# EAGLE design Half_Inch_VCO_ Eval (EAGLE 7.2.0)
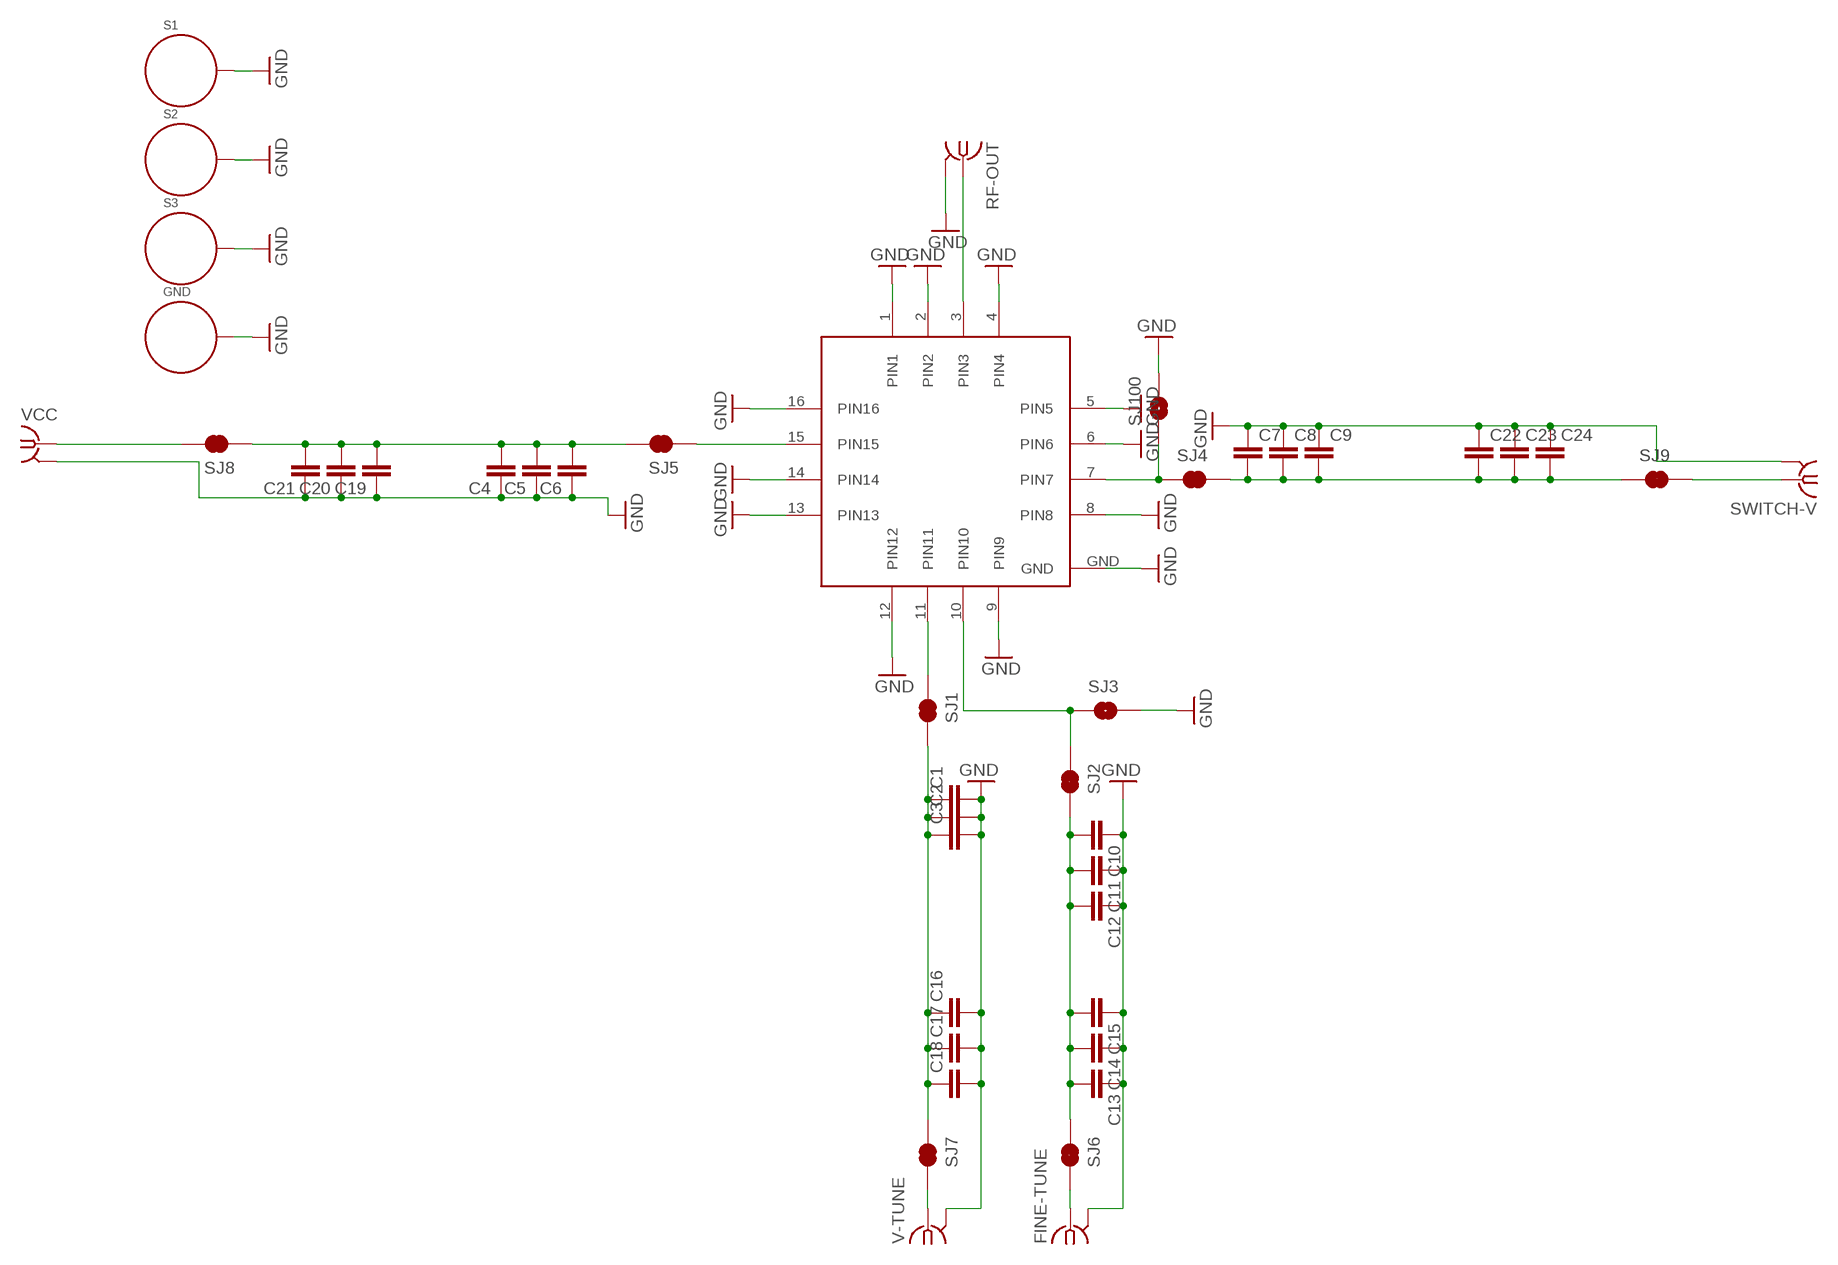
[diagram p0: schematic, sheet 1]

## Parts
C1  CAP0402-CAP  [0402-CAP]
C2  CAP0402-CAP  [0402-CAP]
C3  CAP0402-CAP  [0402-CAP]
C4  CAP0402-CAP  [0402-CAP]
C5  CAP0402-CAP  [0402-CAP]
C6  CAP0402-CAP  [0402-CAP]
C7  CAP0402-CAP  [0402-CAP]
C8  CAP0402-CAP  [0402-CAP]
C9  CAP0402-CAP  [0402-CAP]
C10  CAP0402-CAP  [0402-CAP]
C11  CAP0402-CAP  [0402-CAP]
C12  CAP0402-CAP  [0402-CAP]
C13  CAP0402-CAP  [0402-CAP]
C14  CAP0402-CAP  [0402-CAP]
C15  CAP0402-CAP  [0402-CAP]
C16  CAP0402-CAP  [0402-CAP]
C17  CAP0402-CAP  [0402-CAP]
C18  CAP0402-CAP  [0402-CAP]
C19  CAP0402-CAP  [0402-CAP]
C20  CAP0402-CAP  [0402-CAP]
C21  CAP0402-CAP  [0402-CAP]
C22  CAP0402-CAP  [0402-CAP]
C23  CAP0402-CAP  [0402-CAP]
C24  CAP0402-CAP  [0402-CAP]
FINE-TUNE  SMA-142-0701-801/806  [J502-ND-142-0701-801/806]
GND  STANDOFF_ELECTRICAL  [STANDOFF-ELECTRICAL]
RF-OUT  SMA-142-0701-871/876  [J502-ND-142-0701-871/876]
S1  STANDOFF_ELECTRICAL  [STANDOFF-ELECTRICAL]
S2  STANDOFF_ELECTRICAL  [STANDOFF-ELECTRICAL]
S3  STANDOFF_ELECTRICAL  [STANDOFF-ELECTRICAL]
SJ1  JUMPER-PAD-2-NC_BY_TRACE  [PAD-JUMPER-2-NC_BY_TRACE_YES_SILK]
SJ2  JUMPER-PAD-2-NC_BY_TRACE  [PAD-JUMPER-2-NC_BY_TRACE_YES_SILK]
SJ3  SOLDERJUMPER-OLDNC2  [SJ_2S-NOTRACE]
SJ4  JUMPER-PAD-2-NC_BY_TRACE  [PAD-JUMPER-2-NC_BY_TRACE_YES_SILK]
SJ5  JUMPER-PAD-2-NC_BY_TRACE  [PAD-JUMPER-2-NC_BY_TRACE_YES_SILK]
SJ6  JUMPER-PAD-2-NC_BY_TRACE  [PAD-JUMPER-2-NC_BY_TRACE_YES_SILK]
SJ7  JUMPER-PAD-2-NC_BY_TRACE  [PAD-JUMPER-2-NC_BY_TRACE_YES_SILK]
SJ8  JUMPER-PAD-2-NC_BY_TRACE  [PAD-JUMPER-2-NC_BY_TRACE_YES_SILK]
SJ9  JUMPER-PAD-2-NC_BY_TRACE  [PAD-JUMPER-2-NC_BY_TRACE_YES_SILK]
SJ100  SOLDERJUMPER-OLDNC2  [SJ_2S-NOTRACE]
SWITCH-V  SMA-142-0701-801/806  [J502-ND-142-0701-801/806]
U$1  RFVC6406  [RFVC6406]
V-TUNE  SMA-142-0701-801/806  [J502-ND-142-0701-801/806]
VCC  SMA-142-0701-801/806  [J502-ND-142-0701-801/806]

## Nets
GND: C1.2 C2.2 C3.2 C4.1 C5.1 C6.1 C7.1 C8.1 C9.1 C10.1 C11.1 C12.1 C13.1 C14.1 C15.1 C16.2 C17.2 C18.2 C19.1 C20.1 C21.1 C22.1 C23.1 C24.1 FINE-TUNE.G@1 FINE-TUNE.G@2 FINE-TUNE.G@3 FINE-TUNE.G@4 GND.P1 RF-OUT.G@1 RF-OUT.G@2 RF-OUT.G@3 RF-OUT.G@4 S1.P1 S2.P1 S3.P1 SJ3.2 SJ100.2 SWITCH-V.G@1 SWITCH-V.G@2 SWITCH-V.G@3 SWITCH-V.G@4 U$1.1(PIN1) U$1.2(PIN2) U$1.4(PIN4) U$1.5(PIN5) U$1.6(PIN6) U$1.8(PIN8) U$1.9(PIN9) U$1.12(PIN12) U$1.13(PIN13) U$1.14(PIN14) U$1.16(PIN16) U$1.GND V-TUNE.G@1 V-TUNE.G@2 V-TUNE.G@3 V-TUNE.G@4 VCC.G@1 VCC.G@2 VCC.G@3 VCC.G@4
N$1: SJ8.2 VCC.1
N$2: RF-OUT.1 U$1.3(PIN3)
N$3: C4.2 C5.2 C6.2 C19.2 C20.2 C21.2 SJ5.2 SJ8.1
N$4: SJ5.1 U$1.15(PIN15)
N$5: FINE-TUNE.1 SJ6.2
N$6: SJ4.1 SJ100.1 U$1.7(PIN7)
N$7: C7.2 C8.2 C9.2 C22.2 C23.2 C24.2 SJ4.2 SJ9.1
N$8: SJ9.2 SWITCH-V.1
N$26: SJ1.1 U$1.11(PIN11)
N$28: C1.1 C2.1 C3.1 C16.1 C17.1 C18.1 SJ1.2 SJ7.1
N$30: SJ7.2 V-TUNE.1
N$34: C10.2 C11.2 C12.2 C13.2 C14.2 C15.2 SJ2.2 SJ6.1
N$36: SJ2.1 SJ3.1 U$1.10(PIN10)

## Library data of the parts
C1-C24 = SparkFun-Capacitors:CAP: Capacitor Standard 0603 ceramic capacitor, and 0.1" leaded capacitor.
FINE-TUNE SWITCH-V V-TUNE VCC = con-coax:SMA-: SMA 50 Ohm End Launch Jack Receptacle - Round Contact Johnson Components Source: www.johnsoncomponents.com .. J502-ND.pdf; MF: JOHNSON COMPONENTS; MPN: 142-0701-801; OC_FARNELL: 1608592; OC_NEWARK: 90F2624
GND S1-S3 = SparkFun-Electromechanical:STANDOFF_ELECTRICAL: A standoff intended to be an electrically connected point. Pad size and stop size allow for a #4 Phillips pan screw head to make a solid connection to the board.
RF-OUT = SMA-coplanar:SMA-: SMA 50 Ohm End Launch Jack Receptacle - Round Contact Johnson Components Source: www.johnsoncomponents.com .. J502-ND.pdf; MF: JOHNSON COMPONENTS; MPN: 142-0701-871; OC_FARNELL: 1339835; OC_NEWARK: 91B6105
SJ1 SJ2 SJ4-SJ9 = SparkFun-Passives:JUMPER-PAD-2-NC_BY_TRACE
SJ3 SJ100 = SparkFun-Retired:SOLDERJUMPER-OLD: Solder Jumper Standard SMD solder jumper. Used to automate production. Two varients : Normally Open and Normally Closed are the same, but have different paste layers. NC will have a large amount of paste and should jumper during reflow.
U$1 = APA Parts:RFVC6406: Features ■ Octave Bandwidth 2000MHz to 4000MHz ■ -112dBc/Hz Typical at 100kHz Offset ■ POUT 11dBm Typical ■ 5V Supply ■ 45mA Current Consumption Applications ■ Test and Measurement Instrumentation ■ Wideband Radios for Military and Commercial Applications

## Board
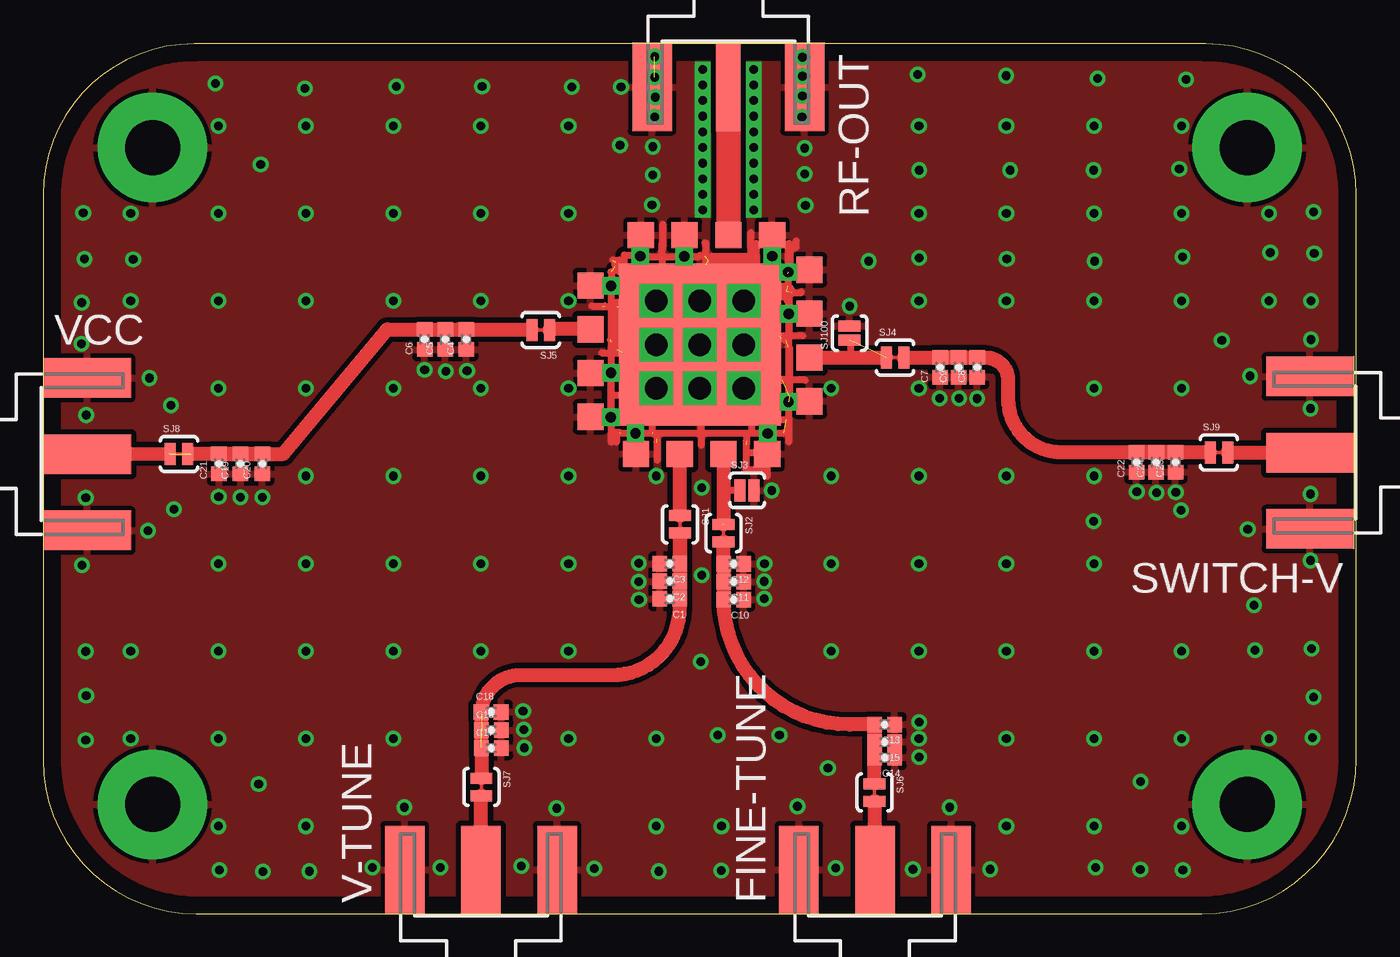
[diagram p1: board, top side]
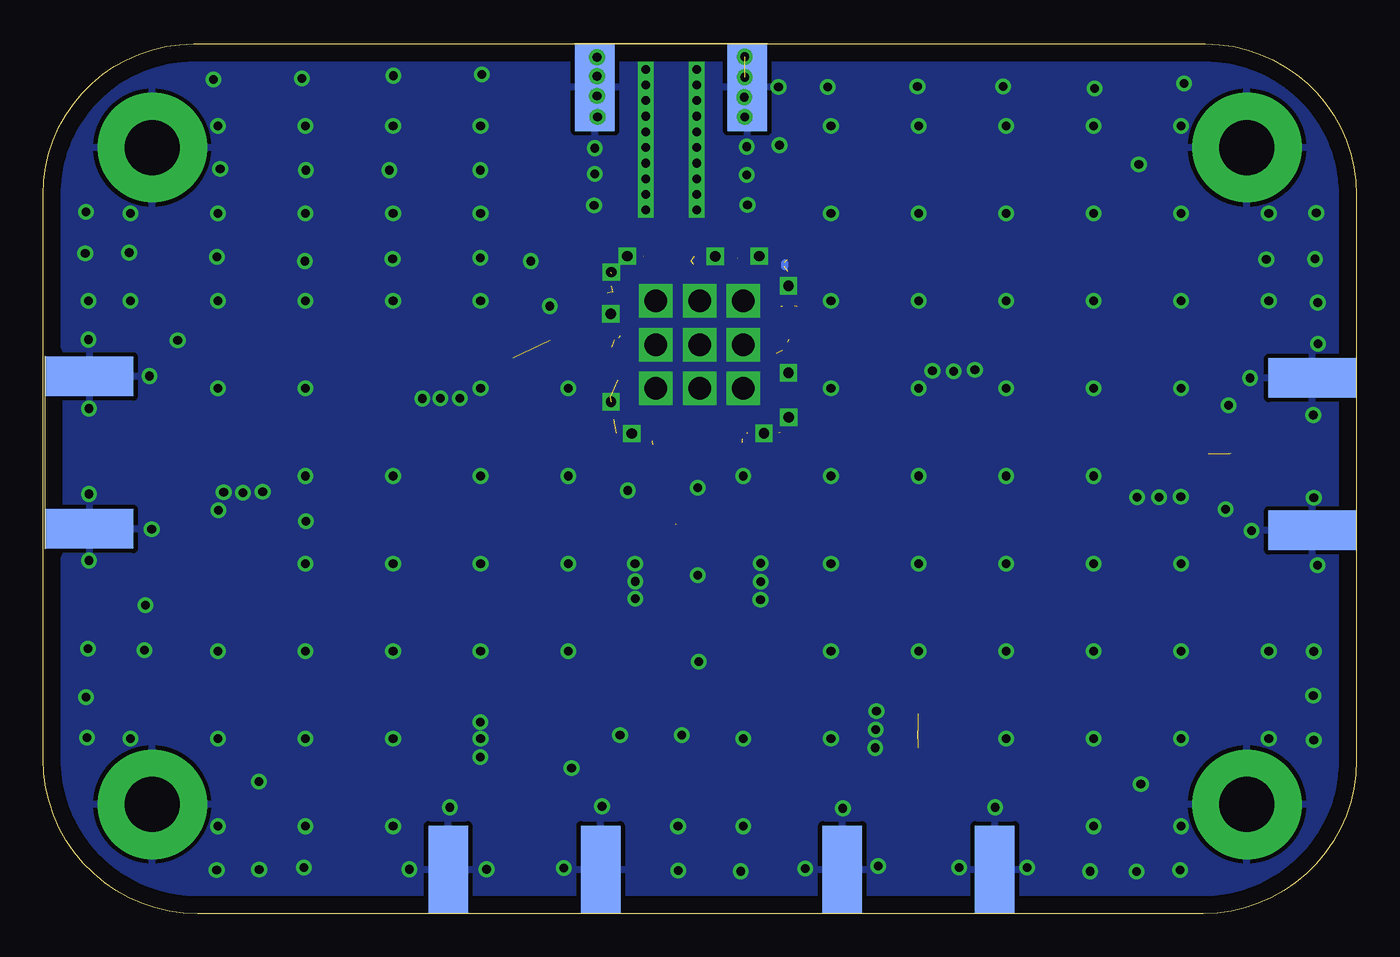
[diagram p2: board, bottom side, seen from below]

Size 76.18 x 50.52 mm. Coordinates in mm from the lower left corner, seen from the top.
Outline: 76.18,8.97 76.18,41.73 arc90 67.44,50.47 8.75,50.47 arc90 0,41.72 0,8.89 arc90 8.89,0 67.21,0 arc90 76.18,8.97
Copper layers (1*16): Top 0.035mm / dielectric 1.5mm / Bottom 0.035mm
Design rules "default *": minimum track width 10mil, minimum drill 24mil, track to track 8mil, track to pad 8mil, pad to pad 8mil, via to via 8mil, smd to smd 8mil, copper to edge 40mil, drill to drill 8mil, minimum pad ring 10mil, minimum via ring 8mil, stop-mask expansion 4mil, vias tented up to drill 0.02mm, thermal gap 10mil

### Footprints (pad centres in the part's own frame; a part is rotated, then mirrored left to right if it is on the bottom)
0402-CAP = smd 0.85 x 0.9: 1 -0.58,0; 2 0.58,0
J502-ND-142-0701-801/806 = smd 5.08 x 2.286: 1 2.565,0; G@1 2.565,4.42; G@2 2.565,-4.42 | smd 5.08 x 2.286 bottom: G@3 2.565,4.42; G@4 2.565,-4.42
STANDOFF-ELECTRICAL = drill 3.2 pad 6.35: P1 0,0
J502-ND-142-0701-871/876 = smd 5.08 x 1.422: 1 2.565,0 | smd 5.08 x 2.286: G@1 2.565,4.42; G@2 2.565,-4.42 | smd 5.08 x 2.286 bottom: G@3 2.565,4.42; G@4 2.565,-4.42
PAD-JUMPER-2-NC_BY_TRACE_YES_SILK = smd 0.635 x 1.27: 1 -0.508,0; 2 0.508,0
SJ_2S-NOTRACE = smd 0.635 x 1.27: 1 -0.401,0; 2 0.413,0
RFVC6406 = smd 1.52 x 1.52: 1 2.92,12.7; 2 5.46,12.7; 3 8,12.7; 4 10.54,12.7; 5 12.7,10.69; 6 12.7,8.15; 7 12.7,5.61; 8 12.7,3.07; 9 10.26,0; 10 7.72,0; 11 5.18,0; 12 2.64,0; 13 0,2.16; 14 0,4.7; 15 0,7.24; 16 0,9.78 | smd 9.4 x 9.4: GND 6.35,6.35

### Placement (x,y rotation side)
C1  36.36,18.27 180 top
C2  36.36,19.29 180 top
C3  36.36,20.31 180 top
C4  24.54,33.33 90 top
C5  23.32,33.33 90 top
C6  22.13,33.33 90 top
C7  52.03,31.71 90 top
C8  54.18,31.71 90 top
C9  53.11,31.7 90 top
C10  40.05,18.24 180 top
C11  40.05,19.27 180 top
C12  40.05,20.3 180 top
C13  48.81,10.99 180 top
C14  48.82,9.06 180 top
C15  48.82,9.97 180 top
C16  26,10.66 0 top
C17  26,9.62 0 top
C18  25.99,11.72 0 top
C19  11.45,26.1 90 top
C20  12.72,26.1 90 top
C21  10.2,26.1 90 top
C22  63.42,26.2 90 top
C23  65.68,26.21 90 top
C24  64.55,26.2 90 top
FINE-TUNE  48.26,0 90 top
GND  69.85,6.35 0 top
RF-OUT  39.75,50.52 270 top
S1  69.85,44.45 0 top
S2  6.35,44.45 0 top
S3  6.35,6.35 0 top
SJ1  36.95,22.59 270 top
SJ2  39.47,22.08 270 top
SJ3  40.83,24.57 0 top
SJ4  49.42,32.27 0 top
SJ5  28.87,33.88 180 top
SJ6  48.23,7.04 270 top
SJ7  25.42,7.36 270 top
SJ8  7.88,26.68 0 top
SJ9  68.2,26.77 0 top
SJ100  46.78,33.69 90 top
SWITCH-V  76.05,26.76 180 top
U$1  31.75,26.67 0 top
V-TUNE  25.4,0 90 top
VCC  0,26.67 0 top

### Tracks (layer width: path | path; a pad name or v marks a point on that pad's centre or on a via)
GND  (via drill 0.5, 0.6, 1.3)  (24 unrouted)
  Top 0.406: 33.14,37.83 33.17,37.83 33.17,37.64 | 33.04,37.93 33.43,37.93 33.43,37.25 | 32.94,37.25 32.96,37.25 32.96,36.84 | 31.84,35.27 32.59,35.27 32.59,35.23 | 32.46,35.23 33.39,35.23 33.39,35.38 | 32.96,33.17 32.96,36.19 | 33.3,35.23 33.3,32.7 | 32.4,32.54 33.64,32.54 | 34.59,38.12 38.04,38.12 38.04,38.13 | 35.91,38.05 35.91,37.33 | 35.95,38.57 35.95,39.98 | 35.62,27.54 35.62,26.33 | 35.34,27.86 35.6,27.86 35.6,27.35 | 33.51,27.88 42.95,27.88 42.95,27.9 | 35.34,27.93 35.34,28.59 | 32.91,33.31 32.96,33.31 32.96,27.37 | 33.43,27.93 33.26,27.93 33.26,27.37 | 41.16,27.88 40.79,27.88 40.79,27.24 | 40.82,27.43 40.78,27.43 40.78,25.79 41.99,25.79 41.99,25.4 | 43.17,35.55 43.24,35.55 43.24,27.39 | 38.18,27.18 38.18,28.5 | 42.77,28.68 43.08,28.68 | 44.2,30.96 42.85,30.96 | 43.21,32.89 43.29,32.89 43.29,29.98 | 44.06,33.52 42.7,33.52 42.7,33.56 | 43.43,36.05 43.98,36.05 43.98,36.09 | 42.64,36.1 42.71,36.03 | 43.21,37.15 43.21,36.43 | 43.36,38.4 43.32,38.4 43.32,37.41 43.24,37.41 43.24,38.91 | 41.08,39.52 41.03,39.52 41.03,38.4 | 38.38,38.92 38.43,38.92 38.43,37.68 | 35.91,38.05 35.89,38.05 35.89,38.84 | 38.75,38.15 41.35,38.15 41.35,37.88 38.59,37.88 38.59,37.85 | 41.35,38.16 41.37,38.16 41.37,38.9 | 43.34,38.66 43.68,38.66 43.68,39.05 | 38.09,38.19 38.38,38.19 38.38,38.15 | 42.8,33.4 43.05,33.4 43.05,33.27
  Top 1.016: 43.12,36.1 42.64,36.1
  Bottom 0.406: 33.17,37.78 33.17,37.54
  other vias: 42.04,27.87 34.36,27.87 32.92,28.81 32.94,31.39 32.94,36.43 34.65,38.16 37.19,38.13 42.3,38.16 43.22,37.23 43.25,34.81 43.23,29.7 46.78,35.25 38.1,33.02 35.56,35.56 35.56,33.02 35.56,30.48 38.1,30.48 40.64,30.48 40.64,33.02 40.64,35.56 38.1,35.56 10.16,45.72 15.24,45.72 20.32,45.72 25.4,45.72 30.48,45.72 35.36,42.86 44.19,44.42 50.8,45.72 55.88,45.72 60.96,45.72 66.04,45.72 66.04,40.64 71.12,40.64 71.12,35.56 70.01,31.2 70.25,17.9 70.3,15.29 71.12,10.16 66.04,5.08 66.04,10.16 66.04,15.24 60.96,5.08 55.88,5.08 52.59,6.18 43.76,6.24 39.35,5.08 35.56,5.08 29.79,6.12 20.96,6.18 15.24,5.08 10.16,5.08 10.16,10.16 10.16,15.24 10.16,20.32 5.08,15.24 5.08,10.16 6.08,22.22 6.18,31.08 5.08,35.56 5.08,40.64 10.16,40.64 15.24,40.64 20.32,40.64 25.4,40.64 30.48,40.64 10.16,35.56 15.24,35.56 20.32,35.56 25.4,35.56 30.48,35.56 10.16,30.48 15.24,25.4 15.24,30.48 15.24,20.32 15.24,15.24 15.24,10.16 20.32,10.16 20.32,15.24 20.32,20.32 20.32,25.4 20.32,30.48 25.4,30.48 25.4,25.4 25.4,20.32 25.4,15.24 30.48,15.24 30.48,20.32 30.48,25.4 30.48,30.48 35.56,25.4 35.56,10.16 30.48,10.16 39.14,10.38 50.8,10.16 55.88,10.16 60.96,10.16 60.96,15.24 55.88,15.24 50.8,15.24 45.72,15.24 45.72,20.32 45.72,25.4 45.72,30.48 50.8,30.48 50.8,25.4 50.8,20.32 55.88,20.32 60.96,20.32 60.94,22.79 60.96,25.4 55.88,25.4 55.88,25.4 60.96,30.48 66.04,30.48 66.04,35.56 60.96,35.56 55.88,35.56 50.8,35.56 60.96,40.64 55.88,40.64 50.8,40.64 44.22,41.09 35.32,41.12 38.27,44.46 38.27,43.55 38.27,42.64 38.27,41.74 38.27,40.83 41.23,44.46 41.23,43.55 41.23,42.64 41.23,41.74 41.23,40.83 38.27,49 38.27,48.09 38.27,47.18 38.27,46.27 38.27,45.37 41.23,49 41.23,48.09 41.23,47.18 41.23,46.27 41.23,45.37 38.15,14.62 38.21,19.65 38.21,24.71 44.17,42.92 33.46,44.59 66.01,23.42 69.88,22.31 45.53,8.46 39.34,2.52 7.58,23.47 7.41,29.51 10.18,24.19 11.44,24.18 12.72,24.18 22.13,31.55 23.35,31.48 24.6,31.51 27.92,9.63 27.88,10.68 27.84,11.75 50.82,9.09 50.82,11.11 41.84,20.32 41.82,19.28 41.82,18.28 34.55,20.34 34.55,19.26 34.57,18.22 42.28,24.56 52.01,29.92 53.14,29.91 54.19,29.9 63.44,24.48 64.6,24.43 65.71,24.45 73.52,20.5 73.56,33.32 54.93,2.58 50.46,2.58 45.98,2.66 42.71,10.37 35.71,2.47 31.98,2.62 27.74,2.77 23.04,2.69 19.09,2.69 15.44,2.47 10.22,2.54 12.75,2.45 2.25,20.22 2.47,15.22 2.47,10.08 12.5,7.53 2.5,12.66 61.05,2.69 66.11,2.54 63.64,2.57 73.57,15.37 73.64,10.23 73.69,12.57 63.65,7.68 73.51,24.36 73.53,29.31 35.37,44.51 33.53,47.97 50.73,48.7 55.87,48.62 61.16,48.47 66.31,48.4 73.74,38.31 73.54,35.57 73.69,40.72 68.37,33.28 2.47,24.14 2.5,28.93 2.23,33.06 2.24,35.46 2.33,40.67 5.23,37.96 30.67,47.97 25.46,48 20.49,48 15.2,47.88 9.99,48.18 12.62,43.48 2.4,37.99 47.9,37.86 50.82,43.15 56.1,43.15 60.94,43.15 65.91,43.21 50.82,38.05 55.91,37.99 61,37.86 66.09,38.11 71.19,38.36 35.48,49.73 35.48,48.54 35.5,47.38 35.48,46.22 44.05,49.7 44.05,48.6 44.05,47.44 44.02,46.22
  pour Top (isolate 0.305): 0.74,0 76.24,-0.09 76.24,0 arc90 76.05,0.19 76.05,50.34 0.09,50.34 0,0.55 0.65,0
  pour Bottom: 76.03,0.2 76.03,50.5 0.22,50.17 0.18,0 76.14,0 76.14,0.09 arc-90
N$1  (1 unrouted)
  Top 0.813: VCC.1 7.29,26.69 7.21,26.7
N$2
  Top 0.406: RF-OUT.1
  Top 1.422: RF-OUT.1 U$1.3
N$3  (1 unrouted)
  Top 0.813: C20.2 8.58,26.68 8.58,26.7 | C20.2 13.93,26.68 19.96,33.9 24.1,33.9 C4.2 | C4.2 28.33,33.91 SJ5.2 | C21.2 C19.2 arc90 C19.2 C20.2 arc-90 C20.2 | C6.2 C5.2 C4.2 | C4.2 arc90 C4.2
N$4
  Top 0.813: U$1.15 29.41,33.91 SJ5.1
N$5
  Top 0.813: FINE-TUNE.1 48.26,6.5 arc90 SJ6.2 SJ6.2 arc-90 SJ6.2
N$6  (1 unrouted)
  Top 0.406: SJ4.1
  Top 0.813: U$1.7 SJ4.1
N$7
  Top 0.813: SJ4.2 54.02,32.27 arc-90 C8.2 | C8.2 54.69,32.27 arc-90 55.97,30.98 55.97,29.86 arc90 59.05,26.79 67.68,26.79 arc-90 SJ9.1 65.7,26.77 arc-90 C23.2 C24.2 arc90 C24.2 C22.2 arc-90 C22.2 | C7.2 C9.2 arc-90 C9.2 C8.2 arc90 C8.2
N$8
  Top 0.813: SJ9.2 73.48,26.77 arc-90 SWITCH-V.1
N$9
  Top 0.406: 46.82,33.27 46.82,32.35
N$12
  Top 0.406: 32.95,35.5 33.67,35.5 33.67,35.59
N$14
  Top 0.406: 41.39,38.19 41.37,38.19 41.37,37.76
N$16
  Top 0.406: 41.12,27.86 41.12,28.41
N$20
  Top 0.406: 43.26,30.99 42.62,30.99 42.62,30.93
N$25
  Top 0.406: 34.26,38.22 33.7,38.22 33.7,37.68 33.66,37.68 33.66,37.31 33.13,37.31 33.13,37.33
N$26
  Top 0.813: U$1.11 36.93,23.18 arc-90 36.92,23.17 36.92,23.13 arc90 SJ1.1
N$28  (2 unrouted)
  Top 0.813: C2.1 C3.1 36.96,22.06 | C2.1 C1.1 | C1.1 arc90 C1.1 | 36.96,22.06 arc-90 36.96,22 | 36.96,22.06 36.96,20.66 arc-90 36.95,20.65 SJ1.2 arc90 SJ1.2 | SJ7.1 25.42,7.93 arc90 25.42,7.94 C18.1 25.42,11.59 arc-90 27.7,13.86 33.04,13.86 arc90 36.93,17.75 C1.1 arc-90 C1.1 | C1.1 C2.1 | C2.1 arc90 C2.1
N$29
  Top 0.406: 32.95,32.13 32.96,32.13 32.96,31.78
N$30
  Top 0.813: V-TUNE.1 25.4,6.73 25.42,6.75 25.45,6.75 arc90 25.46,6.76 25.46,6.74 | 25.46,6.74 | 25.46,6.74 arc90 25.42,6.78 SJ7.2 arc-90 SJ7.2
N$31
  Top 0.406: 32.95,31.02 32.92,31.02 32.92,29.02
N$32
  Top 0.406: 32.98,30.1 33.49,30.1 33.49,30.09
N$34
  Top 0.813: C13.2 46.78,10.99 arc-90 C10.2 | C10.2 arc-90 39.47,18.3 C12.2 39.47,21.51 | 39.47,21.51 arc-90 39.49,21.52 | 39.47,21.51 SJ2.2 arc90 SJ2.2 | SJ6.1 C13.2 arc90 C13.2 | C14.2 C15.2 arc-90 C15.2 48.24,10.98 arc90 C13.2 | C11.2 C10.2 arc90 C10.2
N$35
  Top 0.406: 43.27,35.99 43.26,35.99 43.26,33.69
N$36  (1 unrouted)
  Top 0.406: SJ3.1 39.47,24.56 39.47,24.51
  Top 0.813: U$1.10 39.47,24.51 39.47,22.62 arc-90 39.47,22.61
N$57
  Top 0.406: 40.86,26.77 41.29,26.77 41.29,26.81